# Altium schematic sheet Sheet2.SchDoc
size A3; SheetNumber: 1; SheetTotal: 1
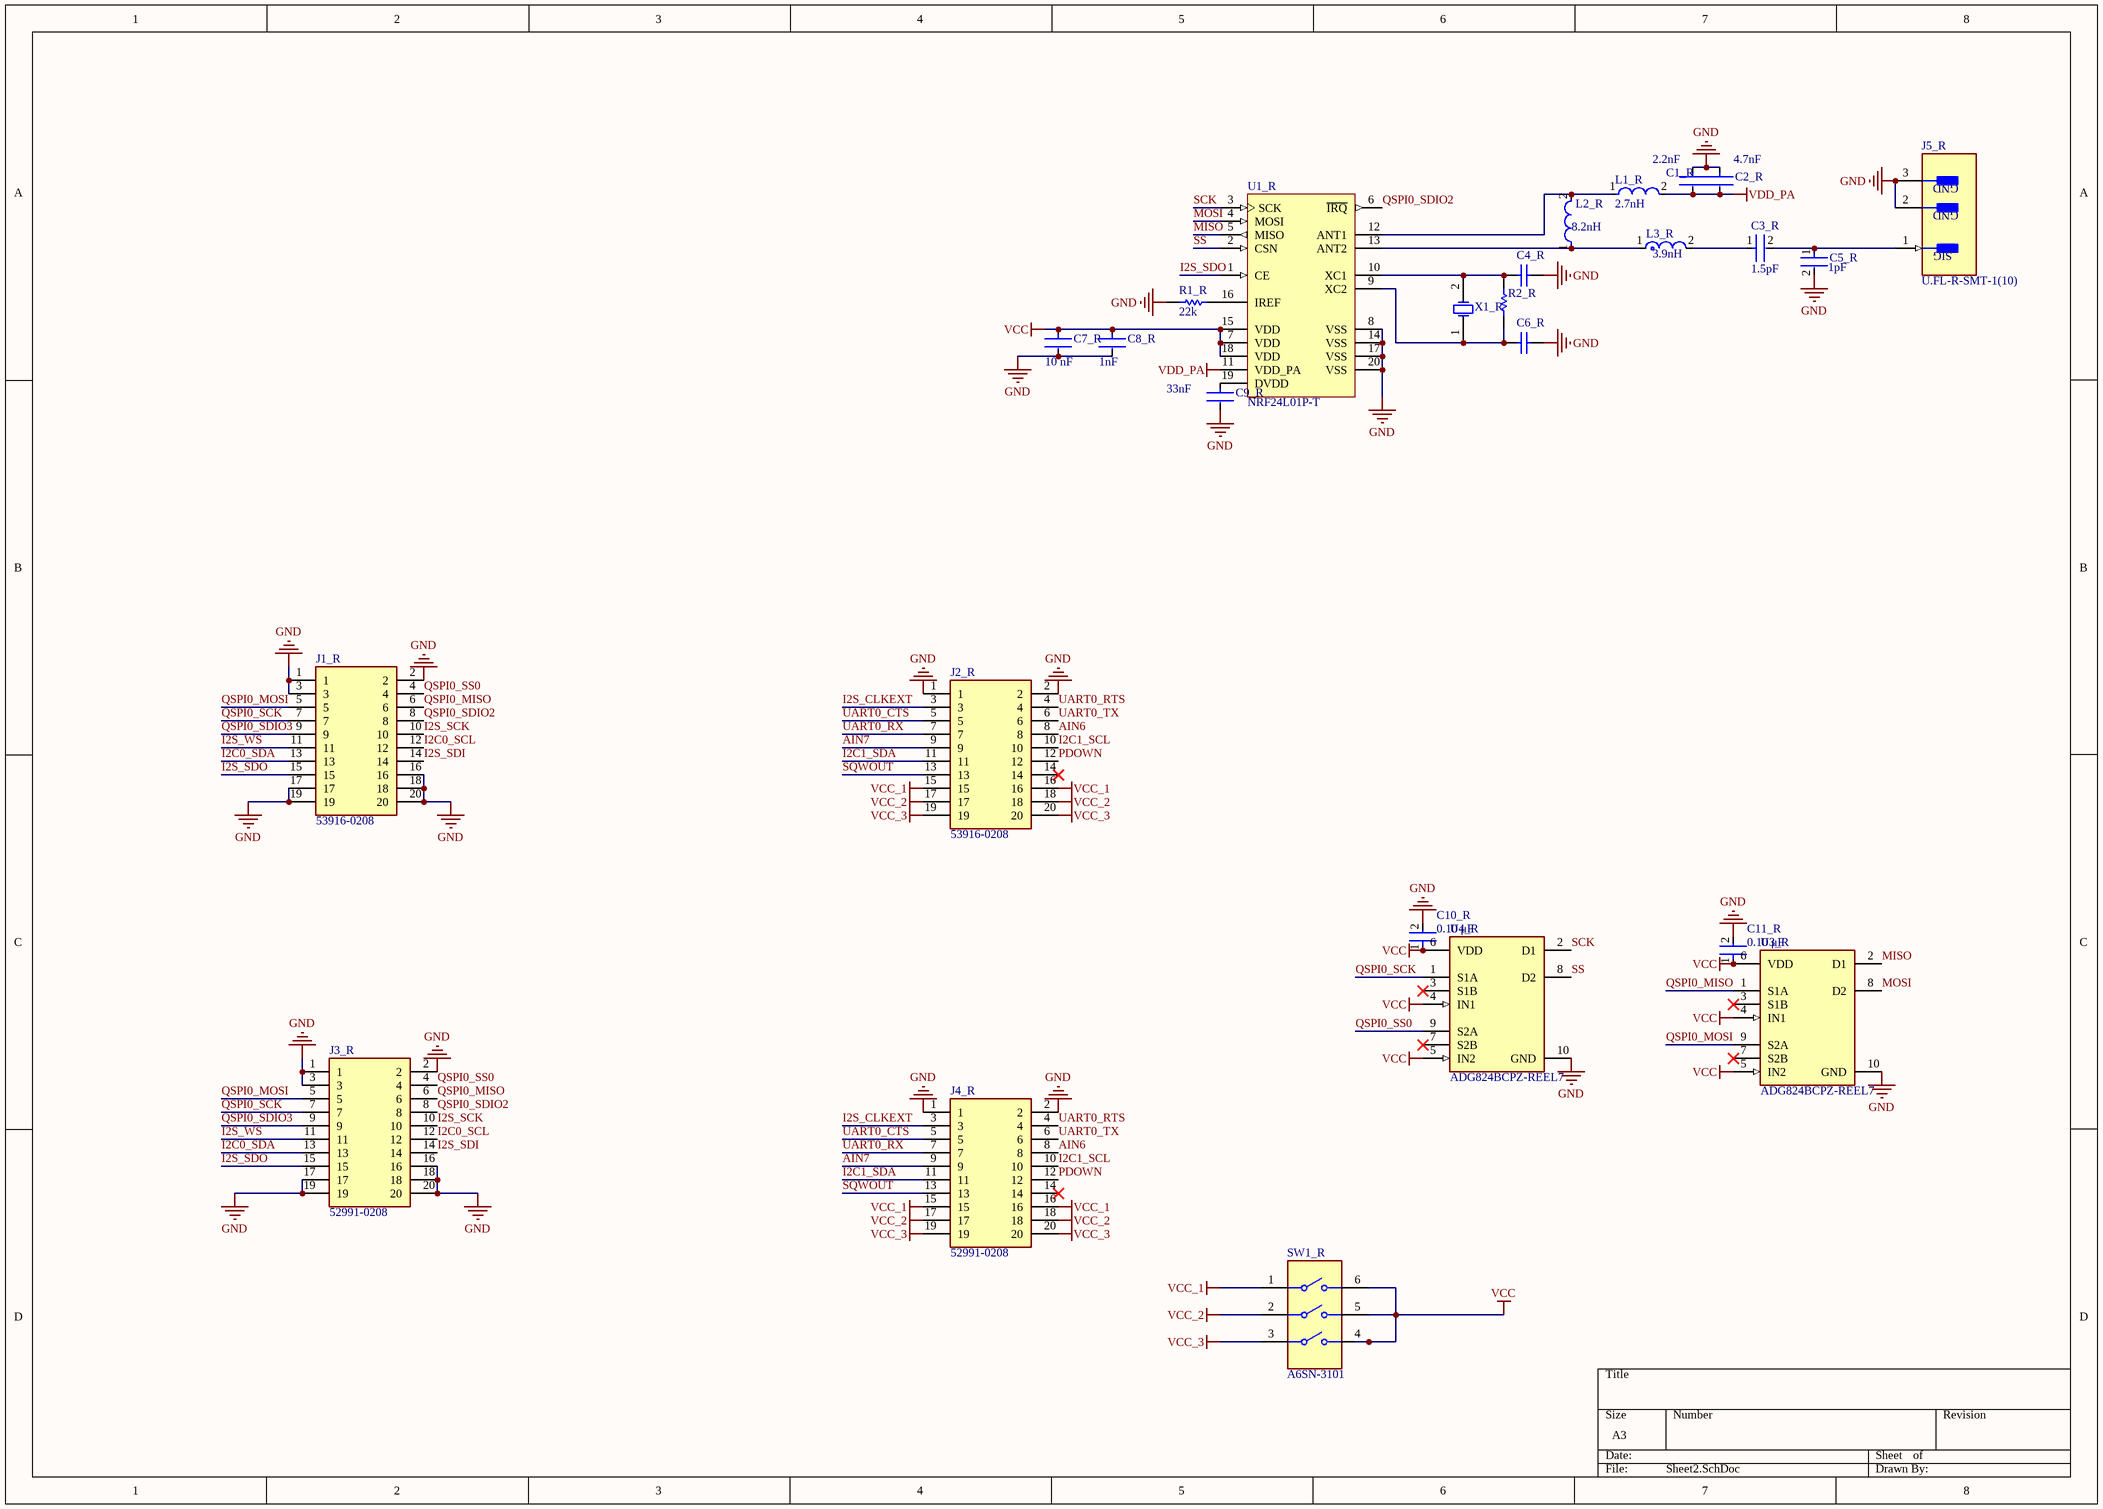
[diagram p0: Sheet2.SchDoc]

## Parts
C1_R  Capacitance: 2.2nF  [FP-GRM155-0_05-IPC_B]  (hidden comment: GRM155R71H222KA01D)
C2_R  Capacitance: 4.7nF  [FP-GRM155-0_05-IPC_B]  (hidden comment: GRM155R71H472KA01D)
C3_R  Capacitance: 1.5pF  [FP-GJM155-0_05-IPC_C]  (hidden comment: GJM1555C1H1R5BB01D)
C4_R  04025A220JAT2A  [CAPC1005X56X25NL10T15]  (value not drawn)
C5_R  Capacitance: 1pF  [FP-GJM155-0_05-IPC_B]  (hidden comment: GJM1555C1H1R0BB01D)
C6_R  04025A220JAT2A  [CAPC1005X56X25NL10T15]  (value not drawn)
C7_R  Capacitance: 10 nF  [FP-CC0402-MFG]  (hidden comment: CC0402KRX7R7BB103)
C8_R  Capacitance: 1nF  [FP-GRM155-0_05-IPC_B]  (hidden comment: GRM1555C1H102JA01D)
C9_R  Capacitance: 33nF  [FP-C0402-BB-MFG]  (hidden comment: C0402C333K4RACTU)
C10_R  Capacitance: 0.10 μF  [FP-C0402-BB-MFG]  (hidden comment: C0402C104K8PACTU)
C11_R  Capacitance: 0.10 μF  [FP-C0402-BB-MFG]  (hidden comment: C0402C104K8PACTU)
J1_R  53916-0208  [MOLEX-  539160208]
J2_R  53916-0208  [MOLEX-  539160208]
J3_R  52991-0208  [MOLEX_52991-0208]
J4_R  52991-0208  [MOLEX_52991-0208]
J5_R  U.FL-R-SMT-1(10)  [FP-U_FL-R-SMT-1_10-MFG]
L1_R  Inductance: 2.7nH  [FP-LQW15AN_00-W0_6-0_1-MFG]  (hidden comment: LQW15AN2N7C00D)
L2_R  Inductance: 8.2nH  [FP-LQW15AN_00-W0_6-0_1-MFG]  (hidden comment: LQW15AN8N2G00D)
L3_R  Inductance: 3.9nH  [FP-LQG15HH_02-MFG]  (hidden comment: LQG15HN3N9S02D)
R1_R  Resistance: 22k  [RESC1005X40X25NL05T05]  (hidden comment: CRCW040222K0FKED)
R2_R  ERJ-3EKF1004V  [RESC1608X55X30LL15T15]  (value not drawn)
SW1_R  A6SN-3101  [FP-A6SN-3101-MFG]
U1_R  NRF24L01P-T  [NRSC-QFN-20_L]
U3_R  ADG824BCPZ-REEL7  [FP-CP-10-10-MFG]
U4_R  ADG824BCPZ-REEL7  [FP-CP-10-10-MFG]
X1_R  FOXSDLF/160-20  [FOX-FOXSDLF160-20_V]  (value not drawn)

## Nets
GND: C1_R.1 C2_R.1 C4_R.2 C5_R.2 C6_R.2 C7_R.2 C8_R.2 C9_R.2 C10_R.2 C11_R.2 J1_R.1 J1_R.2 J1_R.3 J1_R.16 J1_R.17 J1_R.18 J1_R.19 J1_R.20 J2_R.1 J2_R.2 J3_R.1 J3_R.2 J3_R.3 J3_R.16 J3_R.17 J3_R.18 J3_R.19 J3_R.20 J4_R.1 J4_R.2 J5_R.2(GND) J5_R.3(GND) R1_R.1 U1_R.8(VSS) U1_R.14(VSS) U1_R.17(VSS) U1_R.20(VSS) U3_R.10(GND) U4_R.10(GND)
VCC: C7_R.1 C8_R.1 C10_R.1 C11_R.1 SW1_R.4 SW1_R.5 SW1_R.6 U1_R.7(VDD) U1_R.15(VDD) U1_R.18(VDD) U3_R.4(IN1) U3_R.5(IN2) U3_R.6(VDD) U4_R.4(IN1) U4_R.5(IN2) U4_R.6(VDD)
VCC_1: J2_R.15 J2_R.16 J4_R.15 J4_R.16 SW1_R.1
VCC_2: J2_R.17 J2_R.18 J4_R.17 J4_R.18 SW1_R.2
VCC_3: J2_R.19 J2_R.20 J4_R.19 J4_R.20 SW1_R.3
VDD_PA: C1_R.2 C2_R.2 L1_R.2 U1_R.11(VDD_PA)
AIN6: J2_R.8 J4_R.8
AIN7: J2_R.9 J4_R.9
I2C0_SCL: J1_R.12 J3_R.12
I2C0_SDA: J1_R.13 J3_R.13
I2C1_SCL: J2_R.10 J4_R.10
I2C1_SDA: J2_R.11 J4_R.11
I2S_CLKEXT: J2_R.3 J4_R.3
I2S_SCK: J1_R.10 J3_R.10
I2S_SDI: J1_R.14 J3_R.14
I2S_SDO: J1_R.15 J3_R.15 U1_R.1(CE)
I2S_WS: J1_R.11 J3_R.11
MISO: U1_R.5(MISO) U3_R.2(D1)
MOSI: U1_R.4(MOSI) U3_R.8(D2)
PDOWN: J2_R.12 J4_R.12
QSPI0_MISO: J1_R.6 J3_R.6 U3_R.1(S1A)
QSPI0_MOSI: J1_R.5 J3_R.5 U3_R.9(S2A)
QSPI0_SCK: J1_R.7 J3_R.7 U4_R.1(S1A)
QSPI0_SDIO2: J1_R.8 J3_R.8 U1_R.6(~{IRQ})
QSPI0_SDIO3: J1_R.9 J3_R.9
QSPI0_SS0: J1_R.4 J3_R.4 U4_R.9(S2A)
SCK: U1_R.3(SCK) U4_R.2(D1)
SQWOUT: J2_R.13 J4_R.13
SS: U1_R.2(CSN) U4_R.8(D2)
UART0_CTS: J2_R.5 J4_R.5
UART0_RTS: J2_R.4 J4_R.4
UART0_RX: J2_R.7 J4_R.7
UART0_TX: J2_R.6 J4_R.6
NetC3_R_1: C3_R.1 L3_R.2
NetC3_R_2: C3_R.2 C5_R.1 J5_R.1(SIG)
NetC4_R_1: C4_R.1 R2_R.2 U1_R.10(XC1) X1_R.2(X2)
NetC6_R_1: C6_R.1 R2_R.1 U1_R.9(XC2) X1_R.1(X1)
NetC9_R_1: C9_R.1 U1_R.19(DVDD)
NetL1_R_1: L1_R.1 L2_R.2 U1_R.12(ANT1)
NetL2_R_1: L2_R.1 L3_R.1 U1_R.13(ANT2)
NetR1_R_2: R1_R.2 U1_R.16(IREF)

Not connected (* = marked no-connect by the designer): J2_R 14*; J4_R 14*; U3_R 3(S1B)* 7(S2B)*; U4_R 3(S1B)* 7(S2B)*

## Library data of the parts
C1_R = CMP-2008-04653-5: Chip Multilayer Ceramic Capacitors for General Purpose, 0402, 2200pF, X7R, 15%, 10%, 50V; Voltage: 50V; Case/Package: 0402; Case Code (Imperial): 0402; Dielectric: X7R; Thickness: 0.022inch; Number of Pins: 2; Voltage Rating (DC): 50V; Weight: 2.3E-05oz; Min Operating Temperature: -55°C; REACH SVHC: No SVHC; Length: 1mm; Case Code (Metric): 1005; Lead Free: Lead Free; Tolerance: 10%; Max Operating Temperature: 125°C; Package Quantity: 1; Packaging: Tape and Reel; Termination: SMD/SMT; Radiation Hardening: No; Depth: 0.5mm; Material: Ceramic; Width: 0.5mm; Mount: Surface Mount; Voltage Rating: 50V; Height: 0.5mm
C2_R = CMP-2008-04663-5: Chip Multilayer Ceramic Capacitors for General Purpose, 0402, 4700pF, X7R, 15%, 10%, 50V; Voltage: 50V; Case/Package: 0402; Termination: SMD/SMT; Case Code (Metric): 1005; Height: 0.5mm; Voltage Rating: 50V; Packaging: Tape and Reel; Width: 0.02inch; Voltage Rating (DC): 50V; Max Operating Temperature: 125°C; Min Operating Temperature: -55°C; Case Code (Imperial): 0402; Material: Ceramic; Lead Free: Lead Free; Length: 1mm; Package Quantity: 1; Thickness: 0.022inch; Dielectric: X7R; Radiation Hardening: No; Depth: 0.5mm; Mount: Surface Mount; Tolerance: 10%; REACH SVHC: No SVHC
C3_R = CMP-2008-03820-2: Multi-Layer Ceramic Capacitor 1.5pF C0G  ±0.1pF 0402 Paper T/R; Temperature Coefficient: 30ppm/°C; Voltage Rating: 50V; Depth: 0.5mm; Case Code (Imperial): 0402; Package Quantity: 10000; Length: 1mm; Number of Pins: 2; Max Operating Temperature: 125°C; Mount: Surface Mount; Construction: Flat; Thickness: 0.022inch; Series: GJM; Packaging: Tape and Reel; Radiation Hardening: No; REACH SVHC: No SVHC; Case/Package: 0402; Lead Free: Lead Free; Voltage Rating (DC): 50V; Min Operating Temperature: -55°C; Dielectric: C0G; Termination: SMD/SMT; Width: 0.5mm; Lead Pitch: 0.3mm; Case Code (Metric): 1005; Voltage: 50V; Height: 0.5mm
C4_R C6_R = CMP-2008-02613-1: Manufacturer: AVX Interconnect / Elco; Capacitance: 22pF; Part Number: 04025A220JAT2A
C5_R = CMP-2008-03808-2: Multi-Layer Ceramic Capacitor 1pF C0G  ±0.1pF 0402 Paper T/R; Temperature Coefficient: 30ppm/°C; Voltage Rating (DC): 50V; REACH SVHC: No SVHC; Packaging: Tape and Reel; Width: 0.02inch; Package Quantity: 10000; Min Operating Temperature: -55°C; Case Code (Imperial): 0402; Lead Pitch: 0.3mm; Length: 1mm; Max Operating Temperature: 125°C; Depth: 0.5mm; Thickness: 0.022inch; Case Code (Metric): 1005; Lead Free: Lead Free; Voltage: 50V; Mount: Surface Mount; Number of Pins: 2; Termination: SMD/SMT; Radiation Hardening: No; Dielectric: C0G; Case/Package: 0402; Voltage Rating: 50V; Height: 0.5mm
C7_R = CMP-03422-000501-1: CAP CER 10000PF 16V X7R 0402; Manufacturer: YAGEO; Automotive Grade: NA; Material: Ceramic; Value: 10 nF; Tolerance: 0.1; Temperature Coefficient: 30ppm/°C; Temperature Range Low: -55°C; Temperature Range High: +125°C; Mouser Description: 0402 10 nF 16 V ±10 % Tolerance X7R SMT Multilayer Ceramic Capacitor; Footprint Url: http://www.yageo.com/exep/pages/download/literatures/UPY-C_GEN_24.pdf; Category: Cap; RoHS: TRUE; Manufacturer Part Number: CC0402KRX7R7BB103; ComponentLink2Description: Datasheet; Ipc Land Pattern Name: CAPC10050X50; Automotive: No; ComponentLink2URL: http://www.yageo.com/documents/recent/UPY-GP_NP0_16V-to-50V_16.pdf; Device Class L1: Passive Components; Height: 0.55mm; Temperature Characteristic: X7R; Package: CC0402; Voltage Rating: 16 V; Device Class L3: Ceramic Capacitors; Lead Free: Yes; Device Class L2: Capacitors; Digikey Description: CAP CER 10000PF 16V X7R 0402; Octopart: https://octopart.com/cc0402krx7r7bb103-yageo-192895; Temperature: -55°C to +125°C
C8_R = CMP-2008-04254-2: Chip Multilayer Ceramic Capacitors for General Purpose, 0402, 1000pF, C0G, 30ppm/°C, 5%, 50V; Insulation Resistance: 10GR; Packaging: Tape and Reel; Lead Free: Lead Free; Tolerance: 5%; Temperature Coefficient: 30ppm/°C; Thickness: 0.022inch; Termination: SMD/SMT; Max Operating Temperature: 125°C; Height: 0.5mm; Package Quantity: 1; Radiation Hardening: No; Material: Ceramic; Case Code (Metric): 1005; Number of Pins: 2; Voltage Rating: 50V; Mount: Surface Mount; Voltage: 50V; Case/Package: 0402; Min Operating Temperature: -55°C; Dielectric Material: Ceramic; Width: 0.5mm; Depth: 0.5mm; Case Code (Imperial): 0402; REACH SVHC: No SVHC; Dielectric: C0G; Voltage Rating (DC): 50V; Length: 1mm
C9_R = CMP-2008-03182-2: 0402 C 33nF Ceramic Multilayer Capacitor; 16 V; +125degC; X7R Dielectric; +/-10%; Manufacturer: Kemet; Voltage Rating: 16 V; Value: 33,000 pF; Temperature Coefficient: 15%; Tolerance: 0.1; Device Class L3: Ceramic Capacitors; Manufacturer Part Number: C0402C333K4RACTU; Mouser Description: 0402 C 33nF Ceramic Multilayer Capacitor; 16 V; +125degC; X7R Dielectric; +/-10%; Temperature: -55°C to +125°C; Height: 0.55mm; RoHS: TRUE; Digikey Description: 0402 C 33nF Ceramic Multilayer Capacitor; 16 V; +125degC; X7R Dielectric; +/-10%; Lead Free: Yes; Temperature Range Low: -55°C; Octopart: https://octopart.com/c0402c333k4ractu-kemet-128815; Temperature Characteristic: X7R; Automotive: No; Device Class L1: Passive Components; Device Class L2: Capacitors; ComponentLink2URL: https://content.kemet.com/datasheets/KEM_C1002_X7R_SMD.pdf; Material: Ceramic; Ipc Land Pattern Name: CAPC10050X50; ComponentLink2Description: Datasheet; Category: Cap; Temperature Range High: +125°C; Package: C0402-BB
C10_R C11_R = CMP-2008-02046-2: CAP CER 0.1UF 10V X5R 0402; Manufacturer: Kemet; Material: Ceramic; Temperature Coefficient: 15%; Tolerance: 0.1; Value: 0.10 μF; Package: C0402-BB; Temperature: -55°C to +125°C; ComponentLink2Description: Datasheet; Temperature Characteristic: X5R; Device Class L1: Passive Components; Height: 0.55mm; Lead Free: Yes; ComponentLink2URL: https://content.kemet.com/datasheets/KEM_C1002_X7R_SMD.pdf; Device Class L2: Capacitors; Temperature Range Low: -55°C; Temperature Range High: +125°C; RoHS: TRUE; Octopart: https://octopart.com/c0402c104k8pactu-kemet-140039; Automotive: No; Mouser Description: Capacitor 100 nF 10 VDC 0402; Category: Cap; Voltage Rating: 10 V; Digikey Description: CAP CER 0.1UF 10V X5R 0402; Ipc Land Pattern Name: CAPC10050X50; Device Class L3: Ceramic Capacitors; Manufacturer Part Number: C0402C104K8PACTU
J3_R J4_R = 52991-0208: 20 Position Connector Receptacle, Center Strip Contacts Surface Mount Gold; MF: Molex; SnapEDA_Link: https://www.snapeda.com/parts/52991-0208/Molex/view-part/230631/?ref=snap; Availability: Unavailable; MP: 52991-0208; Price: None; Package: None; Value: *
J5_R = CMP-2000-05152-3: CONN U.FL RCPT STR 50 OHM SMD; Max Frequency: 6GHz; Connector Type: Coaxial; Body Plating: Silver; Body Material: Bronze; Impedance: 50R; Dielectric Material: Polymer; Insulation Resistance: 500MR; Gender: Male; Packaging: Cut Tape; Length: 3mm; Package Quantity: 2500; Termination: Solder; Lead Free: Lead Free; Series: U.FL; Min Operating Temperature: -40°C; Fastening Type: Snap; Contact Material: Brass; Orientation: Straight; Wire/Cable Type: Coaxial; Frequency: 6GHz; Contact Plating: Gold; Depth: 3.1mm; Weight: 0.001764oz; Max Operating Temperature: 90°C; Radiation Hardening: No; REACH SVHC: No SVHC; Mount: Surface Mount; Housing Color: Beige
L1_R = CMP-06042-001756-1: Wire Wound RF Inductor 2.7nH ±0.2nH 850mA 0.05Ω 0402 (1005); Shielding: Unshielded; Test Frequency: 100MHz; Current: 750mA; Core Material: Air; Self Resonant Frequency: 15GHz; Q Factor: 20; DC Resistance (DCR): 50mR; Packaging: Tape and Reel; Mount: Surface Mount; Lead Free: Lead Free; Package Quantity: 10000; Max Operating Temperature: 125°C; Height - Seated (Max): 0.024inch; DC Current: 850mA; Min Operating Temperature: -55°C; Case Code (Metric): 1005; Termination: SMD/SMT; Length: 1mm; Depth: 0.7mm; Case Code (Imperial): 0402; Number of Pins: 2; Weight: 2.8E-05oz; REACH SVHC: No SVHC; Width: 0.02inch; Military Standard: Not; Resistor Type: Wirewound; Max DC Current: 850mA; Case/Package: 0402; Radiation Hardening: No; Height: 0.5mm; Current Rating: 850mA
L2_R = CMP-2000-06598-2: Wire Wound RF Inductor 8.2nH ±2% 540mA 0.14Ω 0402 (1005); DC Resistance (DCR): 140mR; Core Material: Air; Q Factor: 25; Test Frequency: 100MHz; Shielding: Unshielded; Self Resonant Frequency: 5.5GHz; DC Current: 540mA; Max DC Current: 540mA; Inductance Tolerance: 2%; Max Operating Temperature: 125°C; Lead Free: Lead Free; Termination: SMD/SMT; Current Rating: 540mA; Depth: 0.7mm; Packaging: Tape and Reel; Mount: Surface Mount; Package Quantity: 10000; Length: 1mm; Case/Package: 0402; Number of Pins: 2; Military Standard: Not; REACH SVHC: No SVHC; Tolerance: 2%; Width: 0.02inch; Case Code (Imperial): 0402; Radiation Hardening: No; Weight: 2.8E-05oz; Min Operating Temperature: -55°C; Height: 0.5mm; Case Code (Metric): 1005
L3_R = CMP-06042-004719-1: Multilayer type RF Inductor 3.9nH ±0.3nH 0.13Ω 700mA 0402; DC Resistance (DCR): 190mR; Core Material: Air; Shielding: Unshielded; Test Frequency: 100MHz; Q Factor: 8; Max DC Current: 300mA; Self Resonant Frequency: 6GHz; Height: 0.02inch; Max Operating Temperature: 125°C; Radiation Hardening: No; Length: 1mm; Military Standard: Not; Case Code (Imperial): 0402; Width: 0.02inch; Package Quantity: 10000; Case Code (Metric): 1005; Number of Pins: 2; Current Rating: 300mA; DC Current: 300mA; Termination: SMD/SMT; Mount: Surface Mount; Lead Free: Lead Free; Min Operating Temperature: -55°C; REACH SVHC: No SVHC; Case/Package: 0402; Packaging: Tape and Reel; Depth: 0.55mm; Height - Seated (Max): 0.022inch
R1_R = CMP-1011-00659-2: Manufacturer: Vishay Dale; Part Number: CRCW040222K0FKED
R2_R = CMP-1012-00849-2: Manufacturer: Panasonic; Resistance: 1M; Part Number: ERJ-3EKF1004V
SW1_R = CMP-08827-000007-1: SWITCH SLIDE DIP SPST 25MA 24V; Manufacturer: Omron Electronics Inc-EMC Div; Electromechanical Life: 1000Cycles; Contact Resistance: 200mΩ; Standoff Height: 0.7mm; Description: DIP Switches / SIP Switches 3P Knife-Edge, 2.3mm Slide SMT Flat-Act; Number Of Circuits: 3; Device Class L2: Switches; Device Class L3: DIP Switches; Ambient Temperature Range High: +85°C; RoHS: TRUE; Temperature Range High: +85°C; Ambient Temperature Range Low: -30°C; ComponentLink2URL: https://omronfs.omron.com/en_US/ecb/products/pdf/en-a6sn.pdf; Category: Switch; Temperature Range Low: -30°C; Digikey Description: SWITCH SLIDE DIP SPST 25MA 24V; Package: A6SN-3101; Mouser Description: DIP Switches / SIP Switches 3P Knife-Edge, 2.3mm Slide SMT Flat-Act; Device Class L1: Electromechanical; Current Rating: 25mA; Lead Free: Yes; ComponentLink2Description: Datasheet; Throw Configuration: SPST; Voltage Rating Dc: 24V; Height: 4.55mm; Octopart: https://octopart.com/a6sn-3101-omron-55396000; Automotive: No; Manufacturer Part Number: A6SN-3101; Temperature: -30°C to +85°C
U1_R = CMP-2000-06859-1: Single Chip Transceiver, 2.4 GHz, 60 mW, 1.9 to 3.6 V, -40 to 85 degC, 20-Pin QFN, RoHS, Tray; Manufacturer: Nordic Semiconductor; Data Rate (Max): 2Mbps; Current - Transmitting: 7mA~11.3mA; Power - Output: 0dBm; Other Names: 1490-1019; Online Catalog: nRF24L01+; Current - Receiving: 12.6mA~13.5mA; For Use With: 1490-1002-ND-KITEVALUATIONNRF24L01P1568-1295-ND-SPARKFUNTRANSCEIVERBREAKOUT-1568-1296-ND-SPARKFUNTRANSCEIVERBREAKOUT-1471-1410-ND-DEVBOARDNRFSCLICKNRF24L01P-MODULE-PCB-ND-KITEVALNRF24L01+PCBANTENNANRF24L01P-MODULE-SMA-ND-KITEVALNRF24L01+SMACONNNRF24L01P-UPGRADE-ND-UPGRADE2PCB/1SMANRF24L01103990038-ND-DEVDUINOSENSORNODEV1.3103990053-ND-DEVDUINOSENSORNODEV2(ATMEGA103990074-ND-DEVDUINOSENSORNODE106990026-ND-ENERGYMONITORSHIELDV2113990088-ND-WIRELESSGATESHIELD113990095-ND-DEVDUINOSENSORNODEV3(ATMEGA106030001-ND-ENERGYMONITORSHIELD1597-1361-ND-DEVDUINOSENSORNODEV2.2(ATMEG105990030-ND-RGBWSTRIPWIRELESSSHIELDV1.0; Frequency: 2.4GHz; Design Resources: DevelopmentToolSelector; RF Family/Standard: GeneralISM>1GHZ; Serial Interfaces: SPI; Sensitivity: -94dBm; Voltage - Supply: 1.9V~3.6V; Modulation: GFSK; GPIO: -; Package Reference: QFN20; Memory Size: -; Category: RF/IFandRFID; Type: TxRxOnly; Standard Package: 490; Package / Case: 20-VFQFNExposedPad; Packaging: Tray; Series: -; Package Description: 20-Pin Quad Flat No-lead Package, Body 4 x 4 mm, Pitch 0.5 mm; Datasheet Version: Rev. 1.0, 09/2008; Protocol: -; Manufacturer URL: http://www.nordicsemi.com/eng/Products/; Operating Temperature: -40°C~85°C; Family: RFTransceiverICs; Datasheet URL: http://www.nordicsemi.com/eng/content/download/2726/34069/file/nRF24L01P_Product_Specification_1_0.pdf; Mounting Technology: SurfaceMount
U3_R U4_R = CMP-09113-000012-1: IC SWITCH DUAL SPDT 10LFCSP; Manufacturer: Analog Devices; Nominal Supply Current: 0.003uA; Max Supply Voltage: 3.6V; Interface: LVCMOS; On State Resistance: 0.5Ω; -3Db Bandwith: 90MHz; Number Of Circuits: 2; Mux Demux Ratio: 1:2; Standoff Height: 0.02mm; Min Supply Voltage: 1.65V; Temperature: -40°C to +85°C; ComponentLink2URL: https://www.analog.com/media/en/technical-documentation/data-sheets/ADG824.pdf; Device Class L2: Interface ICs; Octopart: https://octopart.com/adg824bcpz-reel7-analog+devices-12410880; Temperature Range High: +85°C; Manufacturer Part Number: ADG824BCPZ-REEL7; Lead Free: Yes; Temperature Range Low: -40°C; ComponentLink2Description: Datasheet; Footprint Url: https://www.analog.com/media/en/symbols-footprints/symbols/ADG824BCPZ-REEL7.bxl; RoHS: TRUE; Device Class L3: Analog Switches; Device Class L1: Integrated Circuits (ICs); Automotive: No; Height: 0.6mm; Package: CP-10-10; Throw Configuration: SPDT; Category: IC; Digikey Description: IC SWITCH DUAL SPDT 10LFCSP
X1_R = CMP-1749-00001-1: Resistance Weld SMD Crystal, 16 MHz, +/- 30 ppm, 20 pF, -20 to 70 degC, 2-Pin SMD, RoHS, Tape and Reel; Output Current: 3 mA; Case\Package: SOT-553-6; Min Supply Voltage (DC): 4 V; Max Supply Voltage: 3.3 V; Min Supply Voltage: 1.4 V; Interface: I2C; Max Supply Voltage (DC): 6 V; ComponentLink2Description: Datasheet; REACH SVHC: No SVHC; ComponentLink1URL: http://www.foxonline.com/; ComponentLink2URL: http://foxonline.com/pdfs/hc49sdlf.pdf; Pins: 6; Packaging: Cut Tape; ComponentLink1Description: Manufacturer URL; Weight: 9.9E-05 oz; Length: 1.6 mm; RoHSCompliant: true; Min Operating Temperature: -55 degC; Radiation Hardening: No; PackageDescription: 2-Pin Surface Mount Device, Body 5 x 11.7 mm, Height 4.5 mm; Package Quantity: 1; Width: 1.2 mm; DatasheetVersion: Mar-15; Max Operating Temperature: 150 degC; Mount: Surface Mount; PackageReference: FOX-FOXSDLF160-20; Height: 0.55 mm